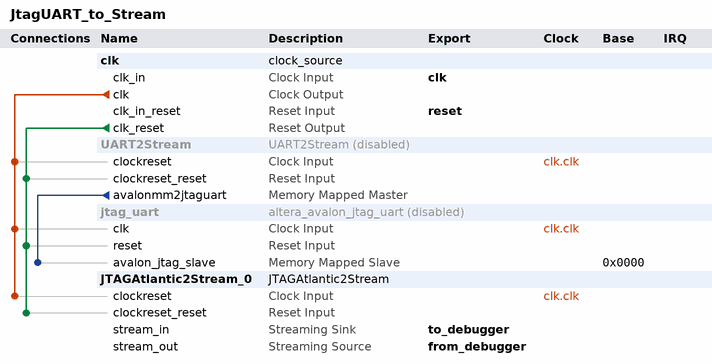
[diagram p0: system contents]
# Platform Designer (Qsys) system JtagUART_to_Stream, Stratix IV EP4SGX230KF40C2
# Parameters at their usual value, and those the tool derives, are not listed.
package require -exact qsys 15.1
create_system JtagUART_to_Stream
set_project_property DEVICE_FAMILY {Stratix IV}
set_project_property DEVICE EP4SGX230KF40C2

add_instance clk clock_source 15.1
set_instance_parameter_value clk clockFrequency 100000000

add_instance UART2Stream UART2Stream 1.0
set_instance_property UART2Stream ENABLED false

add_instance jtag_uart altera_avalon_jtag_uart 15.1
set_instance_property jtag_uart ENABLED false
set_instance_parameter_value jtag_uart simInteractiveOptions INTERACTIVE_ASCII_OUTPUT

add_instance JTAGAtlantic2Stream_0 JTAGAtlantic2Stream 1.0
set_instance_parameter_value JTAGAtlantic2Stream_0 jtag_uart_instance_id 0

# connections
add_connection clk.clk jtag_uart.clk clock
add_connection clk.clk JTAGAtlantic2Stream_0.clockreset clock
add_connection clk.clk UART2Stream.clockreset clock
add_connection clk.clk_reset jtag_uart.reset reset
add_connection clk.clk_reset JTAGAtlantic2Stream_0.clockreset_reset reset
add_connection clk.clk_reset UART2Stream.clockreset_reset reset
add_connection UART2Stream.avalonmm2jtaguart jtag_uart.avalon_jtag_slave avalon
set_connection_parameter_value UART2Stream.avalonmm2jtaguart/jtag_uart.avalon_jtag_slave baseAddress 0x0000

# exported interfaces
add_interface clk clock sink
set_interface_property clk EXPORT_OF clk.clk_in
add_interface from_debugger avalon_streaming source
set_interface_property from_debugger EXPORT_OF JTAGAtlantic2Stream_0.stream_out
add_interface reset reset sink
set_interface_property reset EXPORT_OF clk.clk_in_reset
add_interface to_debugger avalon_streaming sink
set_interface_property to_debugger EXPORT_OF JTAGAtlantic2Stream_0.stream_in

set_interconnect_requirement {$system} qsys_mm.clockCrossingAdapter HANDSHAKE
set_interconnect_requirement {$system} qsys_mm.maxAdditionalLatency 1

save_system JtagUART_to_Stream.qsys
